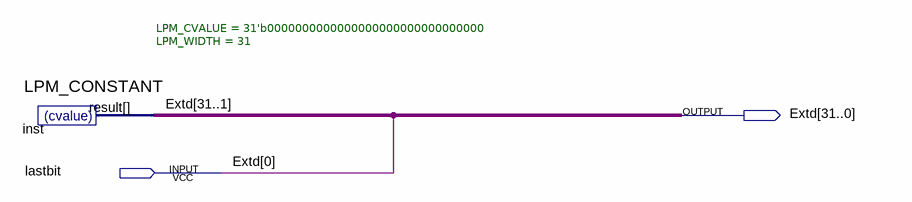
[diagram p0: schematic sheet]
// Quartus schematic zeroextend.bdf as structural Verilog: 1 symbols, 2 pins
module zeroextend (
  input  lastbit,
  output [31:0] Extd
);

  LPM_CONSTANT #(.LPM_CVALUE(31'b0000000000000000000000000000000), .LPM_WIDTH(31)) inst (.result(Extd[31:1]));

  assign Extd[0] = lastbit;
endmodule
